# Altium schematic sheet gmu11.SchDoc
size A; SheetNumber: 6; SheetTotal: 17
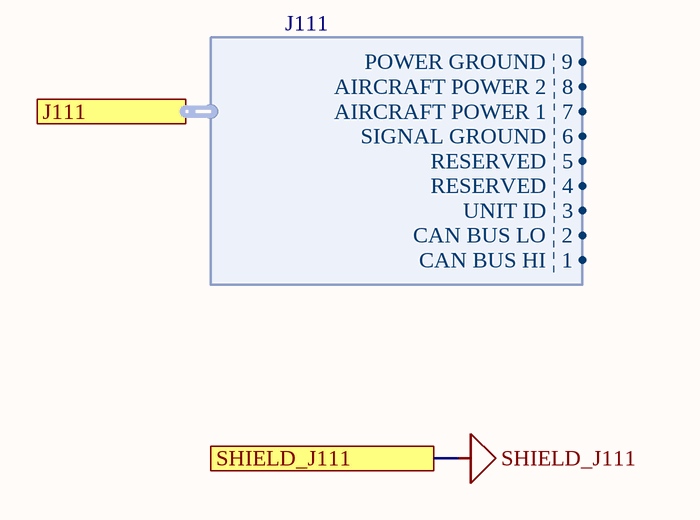
[diagram p0: gmu11.SchDoc]

## Ports
J111 (harness J111), SHIELD_J111

## Harnesses
J111: CAN BUS HI | 1, CAN BUS LO | 2, UNIT ID | 3, RESERVED | 4, RESERVED | 5, SIGNAL GROUND | 6, AIRCRAFT POWER 1 | 7, AIRCRAFT POWER 2 | 8, POWER GROUND | 9

## Nets
SHIELD_J111: port SHIELD_J111